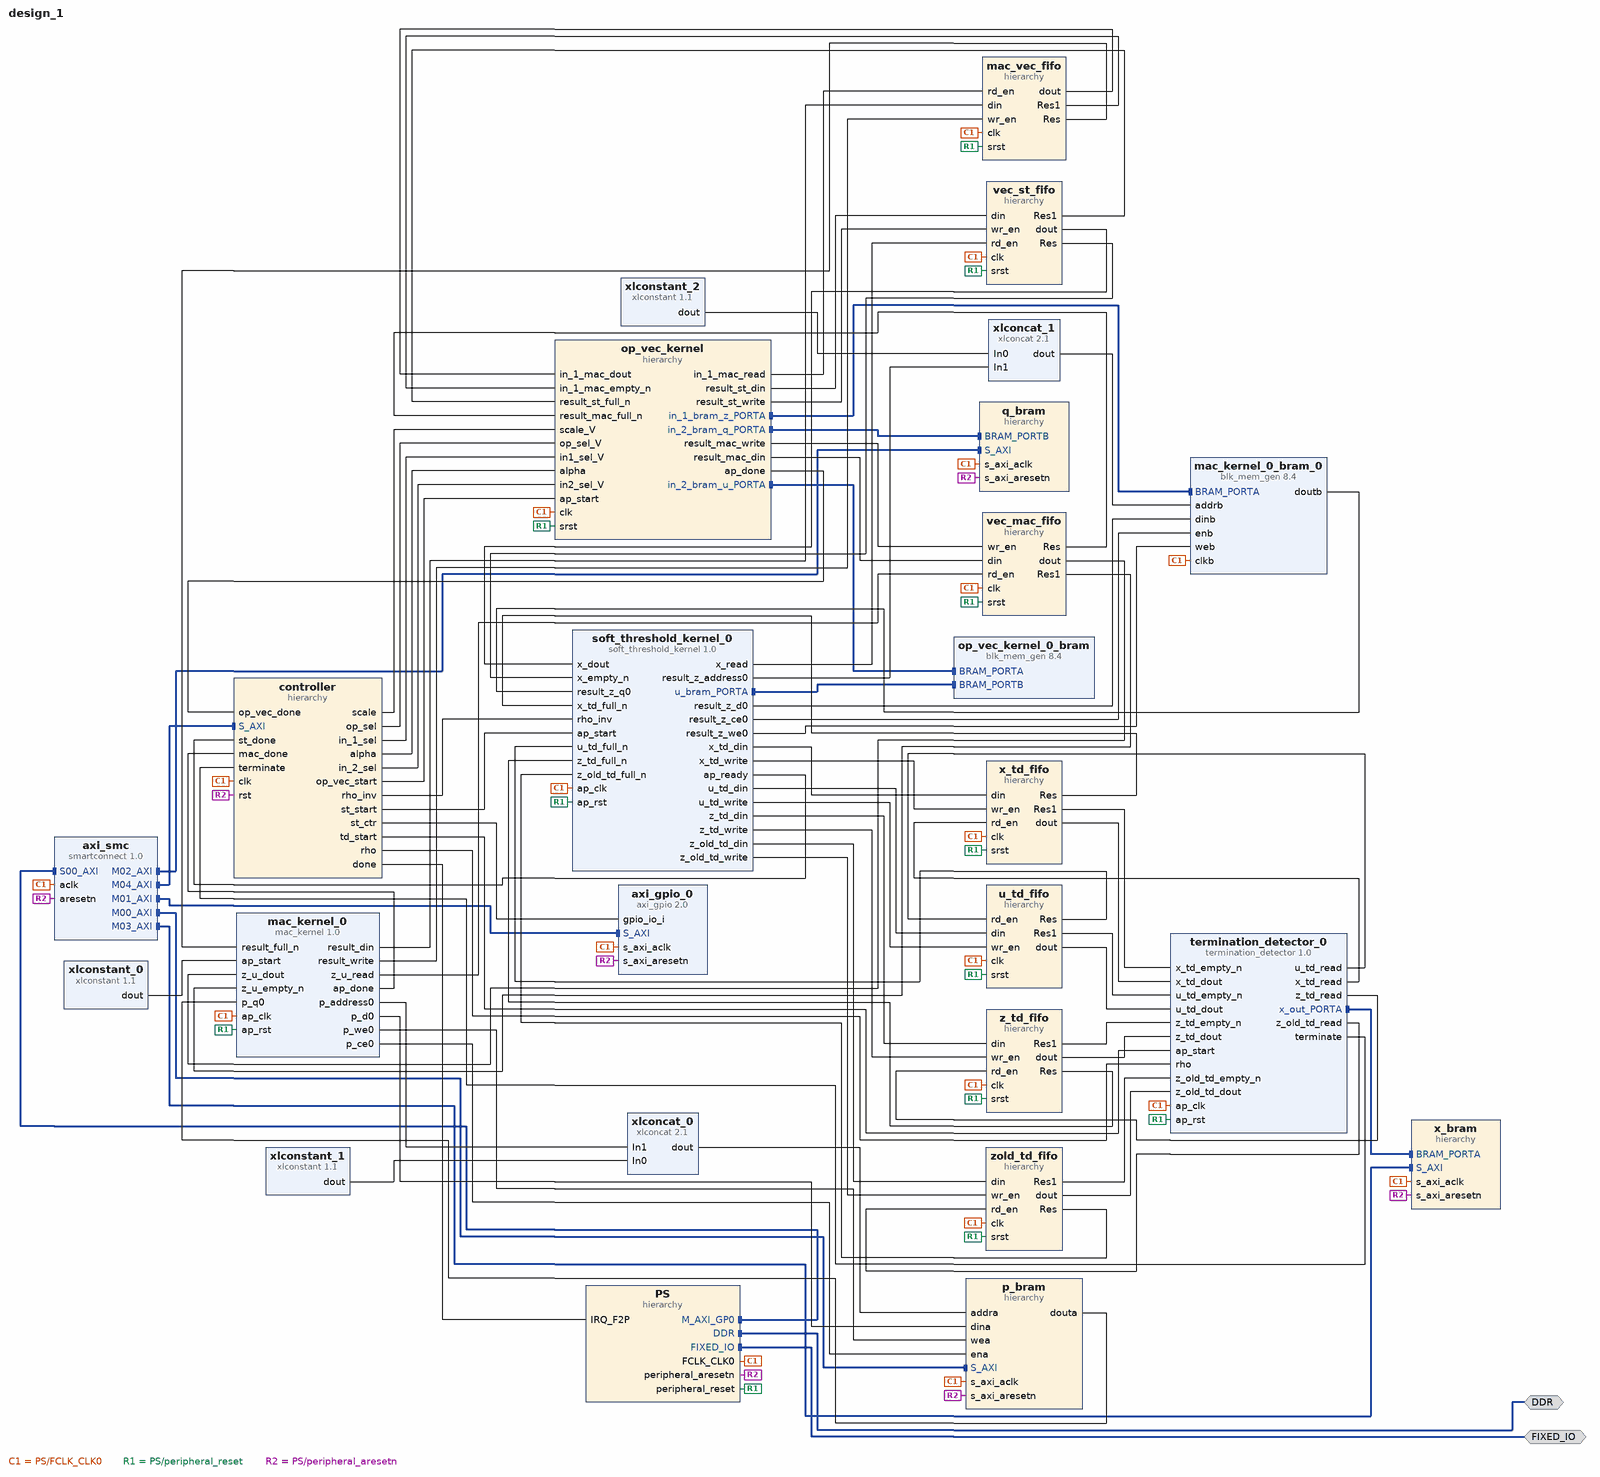
[diagram p0: block diagram of the top level]
# Vivado block design design_1, xc7z020clg484-1, Vivado 2018.3
create_bd_design design_1

create_bd_intf_port -mode Master -vlnv xilinx.com:interface:ddrx_rtl:1.0 DDR
create_bd_intf_port -mode Master -vlnv xilinx.com:display_processing_system7:fixedio_rtl:1.0 FIXED_IO

create_bd_cell -type ip -vlnv xilinx.com:ip:smartconnect:1.0 axi_smc
set_property -dict {CONFIG.NUM_MI 5 CONFIG.NUM_SI 1} [get_bd_cells axi_smc]
create_bd_cell -type ip -vlnv xilinx.com:ip:blk_mem_gen:8.4 mac_kernel_0_bram_0
set_property -dict [list \
  CONFIG.Enable_B Use_ENB_Pin \
  CONFIG.Memory_Type True_Dual_Port_RAM \
  CONFIG.Port_B_Clock 100 \
  CONFIG.Port_B_Enable_Rate 100 \
  CONFIG.Port_B_Write_Rate 50 \
  CONFIG.Use_RSTB_Pin true \
] [get_bd_cells mac_kernel_0_bram_0]
create_bd_cell -type ip -vlnv xilinx.com:ip:blk_mem_gen:8.4 op_vec_kernel_0_bram
set_property -dict [list \
  CONFIG.Enable_B Use_ENB_Pin \
  CONFIG.Memory_Type True_Dual_Port_RAM \
  CONFIG.Port_B_Clock 100 \
  CONFIG.Port_B_Enable_Rate 100 \
  CONFIG.Port_B_Write_Rate 50 \
  CONFIG.Use_RSTB_Pin true \
] [get_bd_cells op_vec_kernel_0_bram]
create_bd_cell -type hier PS
create_bd_cell -type ip -vlnv xilinx.com:hls:mac_kernel:1.0 mac_kernel_0
create_bd_cell -type hier q_bram
create_bd_cell -type hier x_bram
create_bd_cell -type hier p_bram
create_bd_cell -type hier vec_mac_fifo
create_bd_cell -type hier mac_vec_fifo
create_bd_cell -type hier vec_st_fifo
create_bd_cell -type hier op_vec_kernel
create_bd_cell -type hier controller
create_bd_cell -type ip -vlnv xilinx.com:ip:axi_gpio:2.0 axi_gpio_0
set_property -dict {CONFIG.C_ALL_INPUTS 1 CONFIG.C_GPIO_WIDTH 16} [get_bd_cells axi_gpio_0]
create_bd_cell -type ip -vlnv xilinx.com:ip:xlconstant:1.1 xlconstant_0
create_bd_cell -type ip -vlnv xilinx.com:ip:xlconcat:2.1 xlconcat_0
create_bd_cell -type ip -vlnv xilinx.com:ip:xlconstant:1.1 xlconstant_1
set_property -dict {CONFIG.CONST_VAL 0 CONFIG.CONST_WIDTH 2} [get_bd_cells xlconstant_1]
create_bd_cell -type ip -vlnv xilinx.com:hls:soft_threshold_kernel:1.0 soft_threshold_kernel_0
create_bd_cell -type ip -vlnv xilinx.com:ip:xlconcat:2.1 xlconcat_1
create_bd_cell -type ip -vlnv xilinx.com:ip:xlconstant:1.1 xlconstant_2
set_property -dict {CONFIG.CONST_VAL 0 CONFIG.CONST_WIDTH 2} [get_bd_cells xlconstant_2]
create_bd_cell -type hier z_td_fifo
create_bd_cell -type hier x_td_fifo
create_bd_cell -type hier zold_td_fifo
create_bd_cell -type hier u_td_fifo
create_bd_cell -type ip -vlnv xilinx.com:hls:termination_detector:1.0 termination_detector_0

# ---- hierarchy /PS ----
current_bd_instance /PS
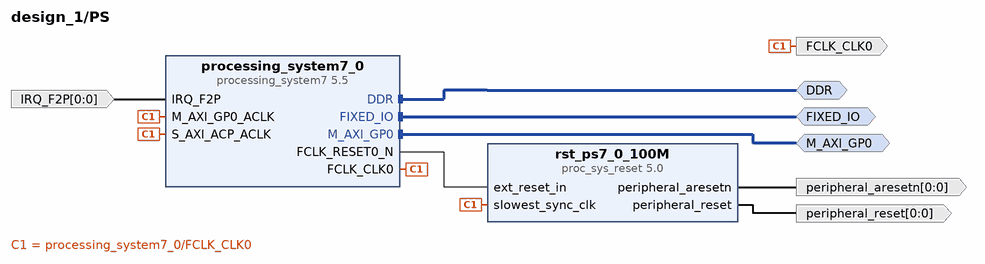
[diagram p1: block diagram inside /PS]
create_bd_intf_pin -mode Master -vlnv xilinx.com:interface:ddrx_rtl:1.0 DDR
create_bd_intf_pin -mode Master -vlnv xilinx.com:display_processing_system7:fixedio_rtl:1.0 FIXED_IO
create_bd_intf_pin -mode Master -vlnv xilinx.com:interface:aximm_rtl:1.0 M_AXI_GP0
create_bd_pin -dir O -type clk FCLK_CLK0
create_bd_pin -dir O -from 0 -to 0 -type rst peripheral_reset
create_bd_pin -dir O -from 0 -to 0 -type rst peripheral_aresetn
create_bd_pin -dir I -from 0 -to 0 -type intr IRQ_F2P

create_bd_cell -type ip -vlnv xilinx.com:ip:proc_sys_reset:5.0 rst_ps7_0_100M
create_bd_cell -type ip -vlnv xilinx.com:ip:processing_system7:5.5 processing_system7_0
set_property -dict [list \
  CONFIG.PCW_APU_PERIPHERAL_FREQMHZ 666.666667 \
  CONFIG.PCW_ENET0_ENET0_IO {MIO 16 .. 27} \
  CONFIG.PCW_ENET0_GRP_MDIO_ENABLE 1 \
  CONFIG.PCW_ENET0_GRP_MDIO_IO {MIO 52 .. 53} \
  CONFIG.PCW_ENET0_PERIPHERAL_ENABLE 1 \
  CONFIG.PCW_ENET0_RESET_ENABLE 0 \
  CONFIG.PCW_ENET_RESET_ENABLE 1 \
  CONFIG.PCW_ENET_RESET_SELECT {Share reset pin} \
  CONFIG.PCW_FPGA0_PERIPHERAL_FREQMHZ 100.000000 \
  CONFIG.PCW_FPGA1_PERIPHERAL_FREQMHZ 150.000000 \
  CONFIG.PCW_GPIO_MIO_GPIO_ENABLE 1 \
  CONFIG.PCW_GPIO_MIO_GPIO_IO MIO \
  CONFIG.PCW_I2C_RESET_ENABLE 1 \
  CONFIG.PCW_IRQ_F2P_INTR 1 \
  CONFIG.PCW_PRESET_BANK1_VOLTAGE {LVCMOS 1.8V} \
  CONFIG.PCW_QSPI_GRP_SINGLE_SS_ENABLE 1 \
  CONFIG.PCW_QSPI_GRP_SINGLE_SS_IO {MIO 1 .. 6} \
  CONFIG.PCW_QSPI_PERIPHERAL_ENABLE 1 \
  CONFIG.PCW_QSPI_QSPI_IO {MIO 1 .. 6} \
  CONFIG.PCW_SD0_GRP_CD_ENABLE 1 \
  CONFIG.PCW_SD0_GRP_CD_IO {MIO 47} \
  CONFIG.PCW_SD0_GRP_WP_ENABLE 1 \
  CONFIG.PCW_SD0_GRP_WP_IO {MIO 46} \
  CONFIG.PCW_SD0_PERIPHERAL_ENABLE 1 \
  CONFIG.PCW_SD0_SD0_IO {MIO 40 .. 45} \
  CONFIG.PCW_SDIO_PERIPHERAL_FREQMHZ 50 \
  CONFIG.PCW_SINGLE_QSPI_DATA_MODE x4 \
  CONFIG.PCW_TTC0_PERIPHERAL_ENABLE 1 \
  CONFIG.PCW_TTC0_TTC0_IO EMIO \
  CONFIG.PCW_UART1_PERIPHERAL_ENABLE 1 \
  CONFIG.PCW_UART1_UART1_IO {MIO 48 .. 49} \
  CONFIG.PCW_UART_PERIPHERAL_FREQMHZ 50 \
  CONFIG.PCW_UIPARAM_DDR_FREQ_MHZ 533.333313 \
  CONFIG.PCW_UIPARAM_DDR_PARTNO {MT41J128M16 HA-15E} \
  CONFIG.PCW_USB0_PERIPHERAL_ENABLE 1 \
  CONFIG.PCW_USB0_RESET_ENABLE 0 \
  CONFIG.PCW_USB0_USB0_IO {MIO 28 .. 39} \
  CONFIG.PCW_USB_RESET_ENABLE 1 \
  CONFIG.PCW_USB_RESET_SELECT {Share reset pin} \
  CONFIG.PCW_USE_FABRIC_INTERRUPT 1 \
  CONFIG.PCW_USE_S_AXI_ACP 1 \
  CONFIG.preset ZedBoard \
] [get_bd_cells processing_system7_0]
# 224 more settings of processing_system7_0 are not shown: defaults, MIO pin electricals, DDR timing, and values the tool derives

# ---- hierarchy /q_bram ----
current_bd_instance /q_bram
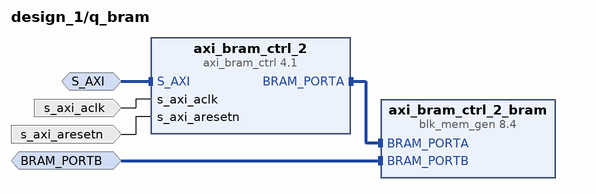
[diagram p2: block diagram inside /q_bram]
create_bd_intf_pin -mode Slave -vlnv xilinx.com:interface:aximm_rtl:1.0 S_AXI
create_bd_intf_pin -mode Slave -vlnv xilinx.com:interface:bram_rtl:1.0 BRAM_PORTB
create_bd_pin -dir I -type clk s_axi_aclk
create_bd_pin -dir I -type rst s_axi_aresetn

create_bd_cell -type ip -vlnv xilinx.com:ip:axi_bram_ctrl:4.1 axi_bram_ctrl_2
set_property -dict {CONFIG.SINGLE_PORT_BRAM 1} [get_bd_cells axi_bram_ctrl_2]
create_bd_cell -type ip -vlnv xilinx.com:ip:blk_mem_gen:8.4 axi_bram_ctrl_2_bram
set_property -dict [list \
  CONFIG.Enable_B Use_ENB_Pin \
  CONFIG.Memory_Type True_Dual_Port_RAM \
  CONFIG.Port_B_Clock 100 \
  CONFIG.Port_B_Enable_Rate 100 \
  CONFIG.Port_B_Write_Rate 50 \
  CONFIG.Use_RSTB_Pin true \
] [get_bd_cells axi_bram_ctrl_2_bram]

# ---- hierarchy /x_bram ----
current_bd_instance /x_bram
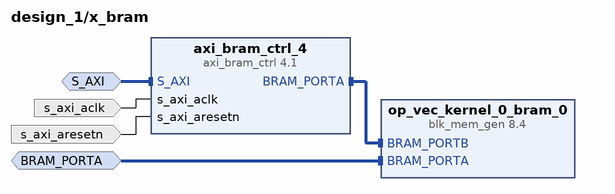
[diagram p3: block diagram inside /x_bram]
create_bd_intf_pin -mode Slave -vlnv xilinx.com:interface:bram_rtl:1.0 BRAM_PORTA
create_bd_intf_pin -mode Slave -vlnv xilinx.com:interface:aximm_rtl:1.0 S_AXI
create_bd_pin -dir I -type clk s_axi_aclk
create_bd_pin -dir I -type rst s_axi_aresetn

create_bd_cell -type ip -vlnv xilinx.com:ip:blk_mem_gen:8.4 op_vec_kernel_0_bram_0
set_property -dict [list \
  CONFIG.Enable_B Use_ENB_Pin \
  CONFIG.Memory_Type True_Dual_Port_RAM \
  CONFIG.Port_B_Clock 100 \
  CONFIG.Port_B_Enable_Rate 100 \
  CONFIG.Port_B_Write_Rate 50 \
  CONFIG.Use_RSTB_Pin true \
] [get_bd_cells op_vec_kernel_0_bram_0]
create_bd_cell -type ip -vlnv xilinx.com:ip:axi_bram_ctrl:4.1 axi_bram_ctrl_4
set_property -dict {CONFIG.SINGLE_PORT_BRAM 1} [get_bd_cells axi_bram_ctrl_4]

# ---- hierarchy /p_bram ----
current_bd_instance /p_bram
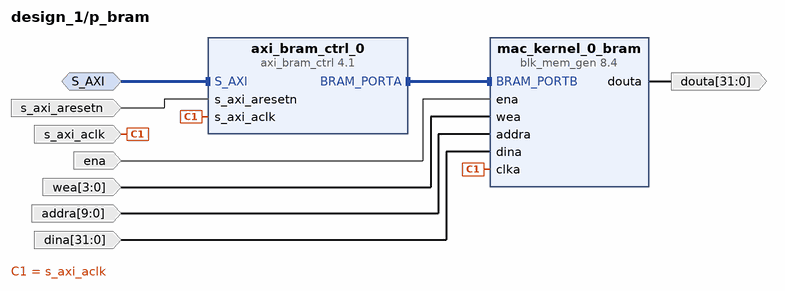
[diagram p4: block diagram inside /p_bram]
create_bd_intf_pin -mode Slave -vlnv xilinx.com:interface:aximm_rtl:1.0 S_AXI
create_bd_pin -dir I -type clk s_axi_aclk
create_bd_pin -dir I ena
create_bd_pin -dir I -from 3 -to 0 wea
create_bd_pin -dir I -from 9 -to 0 addra
create_bd_pin -dir I -from 31 -to 0 dina
create_bd_pin -dir O -from 31 -to 0 douta
create_bd_pin -dir I -type rst s_axi_aresetn

create_bd_cell -type ip -vlnv xilinx.com:ip:blk_mem_gen:8.4 mac_kernel_0_bram
set_property -dict [list \
  CONFIG.Enable_B Use_ENB_Pin \
  CONFIG.Memory_Type True_Dual_Port_RAM \
  CONFIG.Port_B_Clock 100 \
  CONFIG.Port_B_Enable_Rate 100 \
  CONFIG.Port_B_Write_Rate 50 \
  CONFIG.Use_RSTB_Pin true \
] [get_bd_cells mac_kernel_0_bram]
create_bd_cell -type ip -vlnv xilinx.com:ip:axi_bram_ctrl:4.1 axi_bram_ctrl_0
set_property -dict {CONFIG.SINGLE_PORT_BRAM 1} [get_bd_cells axi_bram_ctrl_0]

# ---- hierarchy /vec_mac_fifo ----
current_bd_instance /vec_mac_fifo
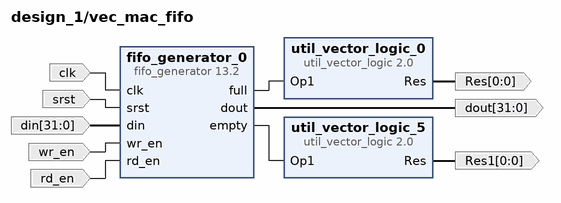
[diagram p5: block diagram inside /vec_mac_fifo]
create_bd_pin -dir O -from 0 -to 0 Res
create_bd_pin -dir O -from 0 -to 0 Res1
create_bd_pin -dir I -type clk clk
create_bd_pin -dir I srst
create_bd_pin -dir I -from 31 -to 0 din
create_bd_pin -dir I wr_en
create_bd_pin -dir I rd_en
create_bd_pin -dir O -from 31 -to 0 dout

create_bd_cell -type ip -vlnv xilinx.com:ip:util_vector_logic:2.0 util_vector_logic_0
set_property -dict {CONFIG.C_OPERATION not CONFIG.C_SIZE 1} [get_bd_cells util_vector_logic_0]
create_bd_cell -type ip -vlnv xilinx.com:ip:util_vector_logic:2.0 util_vector_logic_5
set_property -dict {CONFIG.C_OPERATION not CONFIG.C_SIZE 1} [get_bd_cells util_vector_logic_5]
create_bd_cell -type ip -vlnv xilinx.com:ip:fifo_generator:13.2 fifo_generator_0
set_property -dict [list \
  CONFIG.Data_Count false \
  CONFIG.Input_Data_Width 32 \
  CONFIG.Input_Depth 256 \
  CONFIG.Output_Data_Width 32 \
  CONFIG.Performance_Options First_Word_Fall_Through \
  CONFIG.Reset_Pin true \
  CONFIG.Reset_Type Synchronous_Reset \
  CONFIG.Use_Dout_Reset true \
] [get_bd_cells fifo_generator_0]

# ---- hierarchy /mac_vec_fifo ----
current_bd_instance /mac_vec_fifo
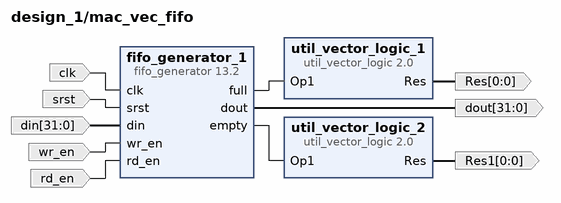
[diagram p6: block diagram inside /mac_vec_fifo]
create_bd_pin -dir O -from 0 -to 0 Res
create_bd_pin -dir O -from 0 -to 0 Res1
create_bd_pin -dir I -type clk clk
create_bd_pin -dir I srst
create_bd_pin -dir I -from 31 -to 0 din
create_bd_pin -dir I wr_en
create_bd_pin -dir I rd_en
create_bd_pin -dir O -from 31 -to 0 dout

create_bd_cell -type ip -vlnv xilinx.com:ip:util_vector_logic:2.0 util_vector_logic_1
set_property -dict {CONFIG.C_OPERATION not CONFIG.C_SIZE 1} [get_bd_cells util_vector_logic_1]
create_bd_cell -type ip -vlnv xilinx.com:ip:util_vector_logic:2.0 util_vector_logic_2
set_property -dict {CONFIG.C_OPERATION not CONFIG.C_SIZE 1} [get_bd_cells util_vector_logic_2]
create_bd_cell -type ip -vlnv xilinx.com:ip:fifo_generator:13.2 fifo_generator_1
set_property -dict [list \
  CONFIG.Input_Data_Width 32 \
  CONFIG.Input_Depth 128 \
  CONFIG.Output_Data_Width 32 \
  CONFIG.Performance_Options First_Word_Fall_Through \
] [get_bd_cells fifo_generator_1]

# ---- hierarchy /vec_st_fifo ----
current_bd_instance /vec_st_fifo
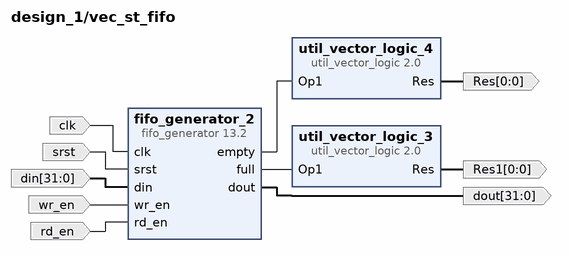
[diagram p7: block diagram inside /vec_st_fifo]
create_bd_pin -dir O -from 0 -to 0 Res
create_bd_pin -dir I -type clk clk
create_bd_pin -dir I srst
create_bd_pin -dir I -from 31 -to 0 din
create_bd_pin -dir I wr_en
create_bd_pin -dir I rd_en
create_bd_pin -dir O -from 31 -to 0 dout
create_bd_pin -dir O -from 0 -to 0 Res1

create_bd_cell -type ip -vlnv xilinx.com:ip:util_vector_logic:2.0 util_vector_logic_4
set_property -dict {CONFIG.C_OPERATION not CONFIG.C_SIZE 1} [get_bd_cells util_vector_logic_4]
create_bd_cell -type ip -vlnv xilinx.com:ip:fifo_generator:13.2 fifo_generator_2
set_property -dict [list \
  CONFIG.Data_Count true \
  CONFIG.Data_Count_Width 8 \
  CONFIG.Input_Data_Width 32 \
  CONFIG.Input_Depth 128 \
  CONFIG.Output_Data_Width 32 \
  CONFIG.Performance_Options First_Word_Fall_Through \
] [get_bd_cells fifo_generator_2]
create_bd_cell -type ip -vlnv xilinx.com:ip:util_vector_logic:2.0 util_vector_logic_3
set_property -dict {CONFIG.C_OPERATION not CONFIG.C_SIZE 1} [get_bd_cells util_vector_logic_3]

# ---- hierarchy /op_vec_kernel ----
current_bd_instance /op_vec_kernel
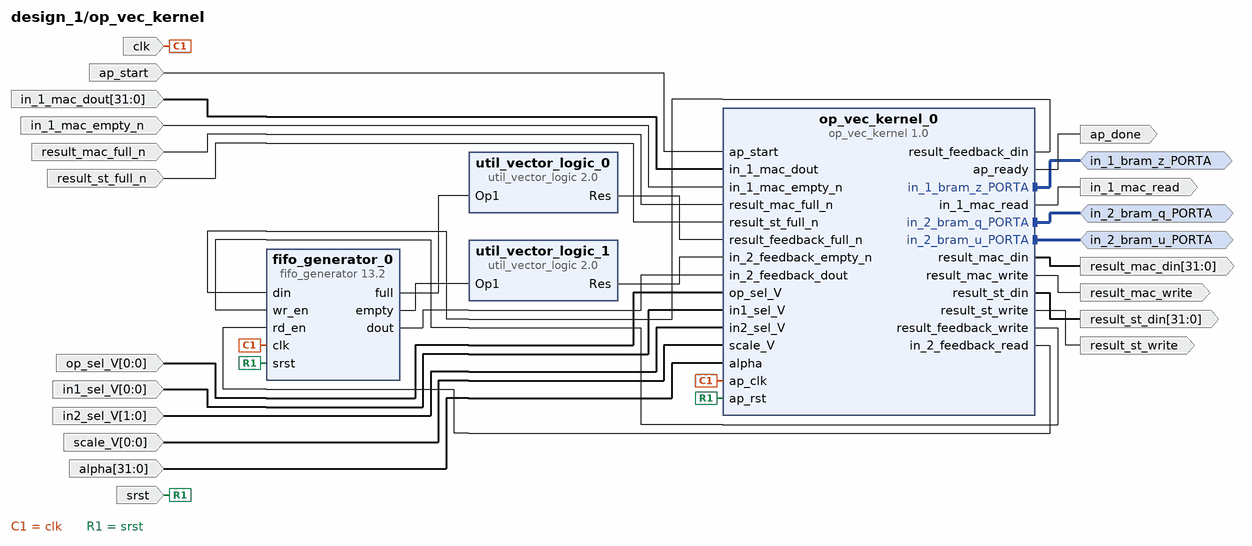
[diagram p8: block diagram inside /op_vec_kernel]
create_bd_intf_pin -mode Master -vlnv xilinx.com:interface:bram_rtl:1.0 in_1_bram_z_PORTA
create_bd_intf_pin -mode Master -vlnv xilinx.com:interface:bram_rtl:1.0 in_2_bram_u_PORTA
create_bd_intf_pin -mode Master -vlnv xilinx.com:interface:bram_rtl:1.0 in_2_bram_q_PORTA
create_bd_pin -dir I -type clk clk
create_bd_pin -dir I srst
create_bd_pin -dir I ap_start
create_bd_pin -dir O ap_done
create_bd_pin -dir I -from 31 -to 0 in_1_mac_dout
create_bd_pin -dir I in_1_mac_empty_n
create_bd_pin -dir O in_1_mac_read
create_bd_pin -dir O -from 31 -to 0 result_mac_din
create_bd_pin -dir I result_mac_full_n
create_bd_pin -dir O result_mac_write
create_bd_pin -dir O -from 31 -to 0 result_st_din
create_bd_pin -dir I result_st_full_n
create_bd_pin -dir O result_st_write
create_bd_pin -dir I -from 0 -to 0 -type data op_sel_V
create_bd_pin -dir I -from 0 -to 0 -type data in1_sel_V
create_bd_pin -dir I -from 1 -to 0 -type data in2_sel_V
create_bd_pin -dir I -from 0 -to 0 -type data scale_V
create_bd_pin -dir I -from 31 -to 0 -type data alpha

create_bd_cell -type ip -vlnv xilinx.com:ip:fifo_generator:13.2 fifo_generator_0
set_property -dict [list \
  CONFIG.Input_Data_Width 32 \
  CONFIG.Input_Depth 128 \
  CONFIG.Output_Data_Width 32 \
  CONFIG.Performance_Options First_Word_Fall_Through \
] [get_bd_cells fifo_generator_0]
create_bd_cell -type ip -vlnv xilinx.com:ip:util_vector_logic:2.0 util_vector_logic_0
set_property -dict {CONFIG.C_OPERATION not CONFIG.C_SIZE 1} [get_bd_cells util_vector_logic_0]
create_bd_cell -type ip -vlnv xilinx.com:ip:util_vector_logic:2.0 util_vector_logic_1
set_property -dict {CONFIG.C_OPERATION not CONFIG.C_SIZE 1} [get_bd_cells util_vector_logic_1]
create_bd_cell -type ip -vlnv xilinx.com:hls:op_vec_kernel:1.0 op_vec_kernel_0

# ---- hierarchy /controller ----
current_bd_instance /controller
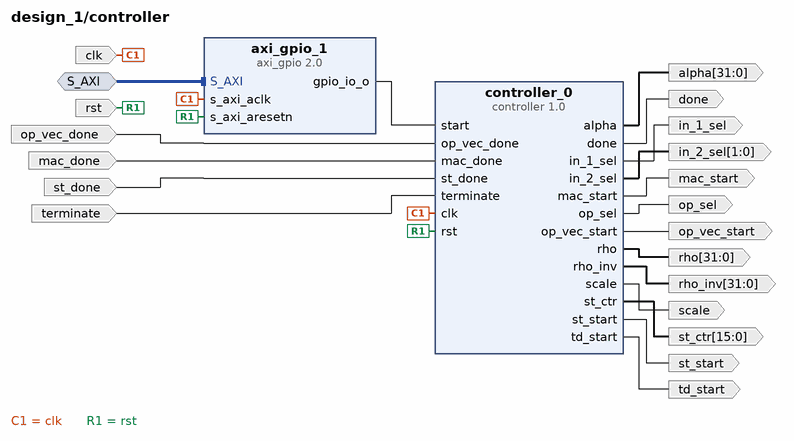
[diagram p9: block diagram inside /controller]
create_bd_intf_pin -mode Slave -vlnv xilinx.com:interface:aximm_rtl:1.0 S_AXI
create_bd_pin -dir I -type clk clk
create_bd_pin -dir I -type rst rst
create_bd_pin -dir I op_vec_done
create_bd_pin -dir I mac_done
create_bd_pin -dir I st_done
create_bd_pin -dir O done
create_bd_pin -dir O scale
create_bd_pin -dir O op_sel
create_bd_pin -dir O in_1_sel
create_bd_pin -dir O -from 31 -to 0 alpha
create_bd_pin -dir O -from 31 -to 0 rho_inv
create_bd_pin -dir O -from 1 -to 0 in_2_sel
create_bd_pin -dir O op_vec_start
create_bd_pin -dir O mac_start
create_bd_pin -dir O st_start
create_bd_pin -dir O -from 15 -to 0 st_ctr
create_bd_pin -dir I terminate
create_bd_pin -dir O td_start
create_bd_pin -dir O -from 31 -to 0 rho

create_bd_cell -type ip -vlnv xilinx.com:ip:axi_gpio:2.0 axi_gpio_1
set_property -dict {CONFIG.C_ALL_INPUTS 0 CONFIG.C_ALL_OUTPUTS 1 CONFIG.C_GPIO_WIDTH 1} [get_bd_cells axi_gpio_1]
create_bd_cell -type ip -vlnv xilinx.com:user:controller:1.0 controller_0
set_property -dict {CONFIG.ITERATION_COUNT 2} [get_bd_cells controller_0]

# ---- hierarchy /z_td_fifo ----
current_bd_instance /z_td_fifo
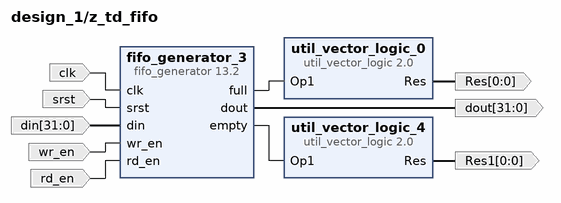
[diagram p10: block diagram inside /z_td_fifo]
create_bd_pin -dir O -from 0 -to 0 Res
create_bd_pin -dir I -type clk clk
create_bd_pin -dir I srst
create_bd_pin -dir I -from 31 -to 0 din
create_bd_pin -dir I wr_en
create_bd_pin -dir I rd_en
create_bd_pin -dir O -from 31 -to 0 dout
create_bd_pin -dir O -from 0 -to 0 Res1

create_bd_cell -type ip -vlnv xilinx.com:ip:util_vector_logic:2.0 util_vector_logic_0
set_property -dict {CONFIG.C_OPERATION not CONFIG.C_SIZE 1} [get_bd_cells util_vector_logic_0]
create_bd_cell -type ip -vlnv xilinx.com:ip:fifo_generator:13.2 fifo_generator_3
set_property -dict [list \
  CONFIG.Input_Data_Width 32 \
  CONFIG.Input_Depth 128 \
  CONFIG.Output_Data_Width 32 \
  CONFIG.Performance_Options First_Word_Fall_Through \
] [get_bd_cells fifo_generator_3]
create_bd_cell -type ip -vlnv xilinx.com:ip:util_vector_logic:2.0 util_vector_logic_4
set_property -dict {CONFIG.C_OPERATION not CONFIG.C_SIZE 1} [get_bd_cells util_vector_logic_4]

# ---- hierarchy /x_td_fifo ----
current_bd_instance /x_td_fifo
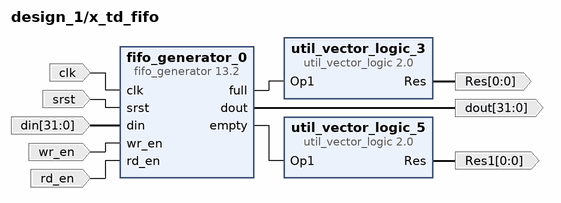
[diagram p11: block diagram inside /x_td_fifo]
create_bd_pin -dir O -from 0 -to 0 Res
create_bd_pin -dir I -type clk clk
create_bd_pin -dir I srst
create_bd_pin -dir I -from 31 -to 0 din
create_bd_pin -dir I wr_en
create_bd_pin -dir I rd_en
create_bd_pin -dir O -from 31 -to 0 dout
create_bd_pin -dir O -from 0 -to 0 Res1

create_bd_cell -type ip -vlnv xilinx.com:ip:util_vector_logic:2.0 util_vector_logic_3
set_property -dict {CONFIG.C_OPERATION not CONFIG.C_SIZE 1} [get_bd_cells util_vector_logic_3]
create_bd_cell -type ip -vlnv xilinx.com:ip:fifo_generator:13.2 fifo_generator_0
set_property -dict [list \
  CONFIG.Input_Data_Width 32 \
  CONFIG.Input_Depth 128 \
  CONFIG.Output_Data_Width 32 \
  CONFIG.Performance_Options First_Word_Fall_Through \
] [get_bd_cells fifo_generator_0]
create_bd_cell -type ip -vlnv xilinx.com:ip:util_vector_logic:2.0 util_vector_logic_5
set_property -dict {CONFIG.C_OPERATION not CONFIG.C_SIZE 1} [get_bd_cells util_vector_logic_5]

# ---- hierarchy /zold_td_fifo ----
current_bd_instance /zold_td_fifo
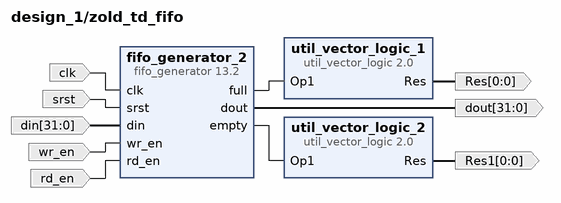
[diagram p12: block diagram inside /zold_td_fifo]
create_bd_pin -dir O -from 0 -to 0 Res
create_bd_pin -dir I -type clk clk
create_bd_pin -dir I srst
create_bd_pin -dir I -from 31 -to 0 din
create_bd_pin -dir I wr_en
create_bd_pin -dir I rd_en
create_bd_pin -dir O -from 31 -to 0 dout
create_bd_pin -dir O -from 0 -to 0 Res1

create_bd_cell -type ip -vlnv xilinx.com:ip:util_vector_logic:2.0 util_vector_logic_1
set_property -dict {CONFIG.C_OPERATION not CONFIG.C_SIZE 1} [get_bd_cells util_vector_logic_1]
create_bd_cell -type ip -vlnv xilinx.com:ip:fifo_generator:13.2 fifo_generator_2
set_property -dict [list \
  CONFIG.Input_Data_Width 32 \
  CONFIG.Input_Depth 128 \
  CONFIG.Output_Data_Width 32 \
  CONFIG.Performance_Options First_Word_Fall_Through \
] [get_bd_cells fifo_generator_2]
create_bd_cell -type ip -vlnv xilinx.com:ip:util_vector_logic:2.0 util_vector_logic_2
set_property -dict {CONFIG.C_OPERATION not CONFIG.C_SIZE 1} [get_bd_cells util_vector_logic_2]

# ---- hierarchy /u_td_fifo ----
current_bd_instance /u_td_fifo
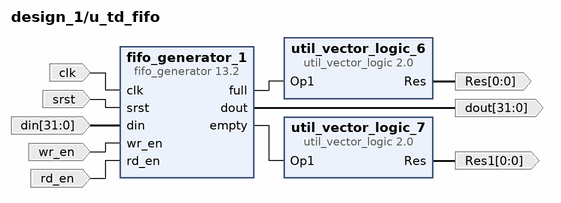
[diagram p13: block diagram inside /u_td_fifo]
create_bd_pin -dir O -from 0 -to 0 Res
create_bd_pin -dir I -type clk clk
create_bd_pin -dir I srst
create_bd_pin -dir I -from 31 -to 0 din
create_bd_pin -dir I wr_en
create_bd_pin -dir I rd_en
create_bd_pin -dir O -from 31 -to 0 dout
create_bd_pin -dir O -from 0 -to 0 Res1

create_bd_cell -type ip -vlnv xilinx.com:ip:util_vector_logic:2.0 util_vector_logic_6
set_property -dict {CONFIG.C_OPERATION not CONFIG.C_SIZE 1} [get_bd_cells util_vector_logic_6]
create_bd_cell -type ip -vlnv xilinx.com:ip:fifo_generator:13.2 fifo_generator_1
set_property -dict [list \
  CONFIG.Input_Data_Width 32 \
  CONFIG.Input_Depth 128 \
  CONFIG.Output_Data_Width 32 \
  CONFIG.Performance_Options First_Word_Fall_Through \
] [get_bd_cells fifo_generator_1]
create_bd_cell -type ip -vlnv xilinx.com:ip:util_vector_logic:2.0 util_vector_logic_7
set_property -dict {CONFIG.C_OPERATION not CONFIG.C_SIZE 1} [get_bd_cells util_vector_logic_7]

# ---- connections ----

current_bd_instance /PS
connect_bd_intf_net [get_bd_intf_pins M_AXI_GP0] [get_bd_intf_pins processing_system7_0/M_AXI_GP0]
connect_bd_intf_net [get_bd_intf_pins FIXED_IO] [get_bd_intf_pins processing_system7_0/FIXED_IO]
connect_bd_intf_net [get_bd_intf_pins DDR] [get_bd_intf_pins processing_system7_0/DDR]
connect_bd_net [get_bd_pins processing_system7_0/FCLK_RESET0_N] [get_bd_pins rst_ps7_0_100M/ext_reset_in]
connect_bd_net [get_bd_pins processing_system7_0/FCLK_CLK0] \
  [get_bd_pins FCLK_CLK0] [get_bd_pins processing_system7_0/M_AXI_GP0_ACLK] [get_bd_pins processing_system7_0/S_AXI_ACP_ACLK] \
  [get_bd_pins rst_ps7_0_100M/slowest_sync_clk]
connect_bd_net [get_bd_pins rst_ps7_0_100M/peripheral_reset] [get_bd_pins peripheral_reset]
connect_bd_net [get_bd_pins rst_ps7_0_100M/peripheral_aresetn] [get_bd_pins peripheral_aresetn]
connect_bd_net -net mac_kernel_0_interrupt [get_bd_pins IRQ_F2P] [get_bd_pins processing_system7_0/IRQ_F2P]
set_property HDL_ATTRIBUTE.BMM_INFO_PROCESSOR {arm > design_1 x_bram/axi_bram_ctrl_4 design_1 q_bram/axi_bram_ctrl_2 design_1 p_bram/axi_bram_ctrl_0} [get_bd_cells processing_system7_0]
set_property HDL_ATTRIBUTE.KEEP_HIERARCHY yes [get_bd_cells processing_system7_0]

current_bd_instance /q_bram
connect_bd_intf_net -intf_net axi_smc_M02_AXI [get_bd_intf_pins S_AXI] [get_bd_intf_pins axi_bram_ctrl_2/S_AXI]
connect_bd_intf_net -intf_net op_vec_kernel_0_in_2_bram_q_PORTA [get_bd_intf_pins BRAM_PORTB] [get_bd_intf_pins axi_bram_ctrl_2_bram/BRAM_PORTB]
connect_bd_intf_net [get_bd_intf_pins axi_bram_ctrl_2_bram/BRAM_PORTA] [get_bd_intf_pins axi_bram_ctrl_2/BRAM_PORTA]
connect_bd_net -net processing_system7_0_FCLK_CLK0 [get_bd_pins s_axi_aclk] [get_bd_pins axi_bram_ctrl_2/s_axi_aclk]
connect_bd_net -net rst_ps7_0_100M_peripheral_aresetn [get_bd_pins s_axi_aresetn] [get_bd_pins axi_bram_ctrl_2/s_axi_aresetn]
set_property HDL_ATTRIBUTE.BMM_INFO_ADDRESS_SPACE {byte  0x44000000 32 > design_1 q_bram/axi_bram_ctrl_2_bram} [get_bd_cells axi_bram_ctrl_2]
set_property HDL_ATTRIBUTE.KEEP_HIERARCHY yes [get_bd_cells axi_bram_ctrl_2]

current_bd_instance /x_bram
connect_bd_intf_net -intf_net op_vec_kernel_0_x_PORTA [get_bd_intf_pins BRAM_PORTA] [get_bd_intf_pins op_vec_kernel_0_bram_0/BRAM_PORTA]
connect_bd_intf_net [get_bd_intf_pins axi_bram_ctrl_4/BRAM_PORTA] [get_bd_intf_pins op_vec_kernel_0_bram_0/BRAM_PORTB]
connect_bd_intf_net -intf_net axi_smc_M03_AXI [get_bd_intf_pins S_AXI] [get_bd_intf_pins axi_bram_ctrl_4/S_AXI]
connect_bd_net -net processing_system7_0_FCLK_CLK0 [get_bd_pins s_axi_aclk] [get_bd_pins axi_bram_ctrl_4/s_axi_aclk]
connect_bd_net -net rst_ps7_0_100M_peripheral_aresetn [get_bd_pins s_axi_aresetn] [get_bd_pins axi_bram_ctrl_4/s_axi_aresetn]
set_property HDL_ATTRIBUTE.BMM_INFO_ADDRESS_SPACE {byte  0x40000000 32 > design_1 x_bram/op_vec_kernel_0_bram_0} [get_bd_cells axi_bram_ctrl_4]
set_property HDL_ATTRIBUTE.KEEP_HIERARCHY yes [get_bd_cells axi_bram_ctrl_4]

current_bd_instance /p_bram
connect_bd_intf_net -intf_net axi_smc_M00_AXI [get_bd_intf_pins S_AXI] [get_bd_intf_pins axi_bram_ctrl_0/S_AXI]
connect_bd_intf_net [get_bd_intf_pins mac_kernel_0_bram/BRAM_PORTB] [get_bd_intf_pins axi_bram_ctrl_0/BRAM_PORTA]
connect_bd_net -net processing_system7_0_FCLK_CLK0 [get_bd_pins s_axi_aclk] \
  [get_bd_pins axi_bram_ctrl_0/s_axi_aclk] [get_bd_pins mac_kernel_0_bram/clka]
connect_bd_net -net mac_kernel_0_p_ce0 [get_bd_pins ena] [get_bd_pins mac_kernel_0_bram/ena]
connect_bd_net -net mac_kernel_0_p_we0 [get_bd_pins wea] [get_bd_pins mac_kernel_0_bram/wea]
connect_bd_net -net mac_kernel_0_p_address0 [get_bd_pins addra] [get_bd_pins mac_kernel_0_bram/addra]
connect_bd_net -net mac_kernel_0_p_d0 [get_bd_pins dina] [get_bd_pins mac_kernel_0_bram/dina]
connect_bd_net [get_bd_pins mac_kernel_0_bram/douta] [get_bd_pins douta]
connect_bd_net -net rst_ps7_0_100M_peripheral_aresetn [get_bd_pins s_axi_aresetn] [get_bd_pins axi_bram_ctrl_0/s_axi_aresetn]
set_property HDL_ATTRIBUTE.BMM_INFO_ADDRESS_SPACE {byte  0x4B000000 32 > design_1 p_bram/mac_kernel_0_bram} [get_bd_cells axi_bram_ctrl_0]
set_property HDL_ATTRIBUTE.KEEP_HIERARCHY yes [get_bd_cells axi_bram_ctrl_0]

current_bd_instance /vec_mac_fifo
connect_bd_net [get_bd_pins fifo_generator_0/full] [get_bd_pins util_vector_logic_0/Op1]
connect_bd_net [get_bd_pins fifo_generator_0/empty] [get_bd_pins util_vector_logic_5/Op1]
connect_bd_net [get_bd_pins util_vector_logic_0/Res] [get_bd_pins Res]
connect_bd_net [get_bd_pins util_vector_logic_5/Res] [get_bd_pins Res1]
connect_bd_net -net processing_system7_0_FCLK_CLK0 [get_bd_pins clk] [get_bd_pins fifo_generator_0/clk]
connect_bd_net -net rst_ps7_0_100M_peripheral_reset [get_bd_pins srst] [get_bd_pins fifo_generator_0/srst]
connect_bd_net -net op_vec_kernel_0_result_mac_din [get_bd_pins din] [get_bd_pins fifo_generator_0/din]
connect_bd_net -net op_vec_kernel_0_result_mac_write [get_bd_pins wr_en] [get_bd_pins fifo_generator_0/wr_en]
connect_bd_net -net mac_kernel_0_z_u_read [get_bd_pins rd_en] [get_bd_pins fifo_generator_0/rd_en]
connect_bd_net [get_bd_pins fifo_generator_0/dout] [get_bd_pins dout]

current_bd_instance /mac_vec_fifo
connect_bd_net [get_bd_pins fifo_generator_1/full] [get_bd_pins util_vector_logic_1/Op1]
connect_bd_net [get_bd_pins fifo_generator_1/empty] [get_bd_pins util_vector_logic_2/Op1]
connect_bd_net [get_bd_pins util_vector_logic_1/Res] [get_bd_pins Res]
connect_bd_net [get_bd_pins util_vector_logic_2/Res] [get_bd_pins Res1]
connect_bd_net -net processing_system7_0_FCLK_CLK0 [get_bd_pins clk] [get_bd_pins fifo_generator_1/clk]
connect_bd_net -net rst_ps7_0_100M_peripheral_reset [get_bd_pins srst] [get_bd_pins fifo_generator_1/srst]
connect_bd_net -net mac_kernel_0_result_din [get_bd_pins din] [get_bd_pins fifo_generator_1/din]
connect_bd_net -net mac_kernel_0_result_write [get_bd_pins wr_en] [get_bd_pins fifo_generator_1/wr_en]
connect_bd_net -net op_vec_kernel_0_in_1_mac_read [get_bd_pins rd_en] [get_bd_pins fifo_generator_1/rd_en]
connect_bd_net [get_bd_pins fifo_generator_1/dout] [get_bd_pins dout]

current_bd_instance /vec_st_fifo
connect_bd_net [get_bd_pins fifo_generator_2/empty] [get_bd_pins util_vector_logic_4/Op1]
connect_bd_net [get_bd_pins fifo_generator_2/full] [get_bd_pins util_vector_logic_3/Op1]
connect_bd_net [get_bd_pins util_vector_logic_4/Res] [get_bd_pins Res]
connect_bd_net -net processing_system7_0_FCLK_CLK0 [get_bd_pins clk] [get_bd_pins fifo_generator_2/clk]
connect_bd_net -net rst_ps7_0_100M_peripheral_reset [get_bd_pins srst] [get_bd_pins fifo_generator_2/srst]
connect_bd_net -net op_vec_kernel_0_result_st_din [get_bd_pins din] [get_bd_pins fifo_generator_2/din]
connect_bd_net -net op_vec_kernel_0_result_st_write [get_bd_pins wr_en] [get_bd_pins fifo_generator_2/wr_en]
connect_bd_net -net soft_threshold_kernel_0_x_read [get_bd_pins rd_en] [get_bd_pins fifo_generator_2/rd_en]
connect_bd_net [get_bd_pins fifo_generator_2/dout] [get_bd_pins dout]
connect_bd_net [get_bd_pins util_vector_logic_3/Res] [get_bd_pins Res1]

current_bd_instance /op_vec_kernel
connect_bd_intf_net [get_bd_intf_pins in_2_bram_q_PORTA] [get_bd_intf_pins op_vec_kernel_0/in_2_bram_q_PORTA]
connect_bd_intf_net [get_bd_intf_pins in_2_bram_u_PORTA] [get_bd_intf_pins op_vec_kernel_0/in_2_bram_u_PORTA]
connect_bd_intf_net [get_bd_intf_pins in_1_bram_z_PORTA] [get_bd_intf_pins op_vec_kernel_0/in_1_bram_z_PORTA]
connect_bd_net -net processing_system7_0_FCLK_CLK0 [get_bd_pins clk] [get_bd_pins fifo_generator_0/clk] [get_bd_pins op_vec_kernel_0/ap_clk]
connect_bd_net -net rst_ps7_0_100M_peripheral_reset [get_bd_pins srst] [get_bd_pins fifo_generator_0/srst] [get_bd_pins op_vec_kernel_0/ap_rst]
connect_bd_net -net controller_0_op_vec_start [get_bd_pins ap_start] [get_bd_pins op_vec_kernel_0/ap_start]
connect_bd_net -net fifo_generator_1_dout [get_bd_pins in_1_mac_dout] [get_bd_pins op_vec_kernel_0/in_1_mac_dout]
connect_bd_net -net util_vector_logic_2_Res [get_bd_pins in_1_mac_empty_n] [get_bd_pins op_vec_kernel_0/in_1_mac_empty_n]
connect_bd_net [get_bd_pins op_vec_kernel_0/in_1_mac_read] [get_bd_pins in_1_mac_read]
connect_bd_net [get_bd_pins op_vec_kernel_0/result_mac_din] [get_bd_pins result_mac_din]
connect_bd_net -net util_vector_logic_0_Res [get_bd_pins result_mac_full_n] [get_bd_pins op_vec_kernel_0/result_mac_full_n]
connect_bd_net [get_bd_pins op_vec_kernel_0/result_mac_write] [get_bd_pins result_mac_write]
connect_bd_net [get_bd_pins op_vec_kernel_0/result_st_din] [get_bd_pins result_st_din]
connect_bd_net -net util_vector_logic_3_Res [get_bd_pins result_st_full_n] [get_bd_pins op_vec_kernel_0/result_st_full_n]
connect_bd_net [get_bd_pins op_vec_kernel_0/result_st_write] [get_bd_pins result_st_write]
connect_bd_net -net controller_0_op_sel [get_bd_pins op_sel_V] [get_bd_pins op_vec_kernel_0/op_sel_V]
connect_bd_net -net controller_0_in_1_sel [get_bd_pins in1_sel_V] [get_bd_pins op_vec_kernel_0/in1_sel_V]
connect_bd_net -net controller_0_in_2_sel [get_bd_pins in2_sel_V] [get_bd_pins op_vec_kernel_0/in2_sel_V]
connect_bd_net -net controller_0_scale [get_bd_pins scale_V] [get_bd_pins op_vec_kernel_0/scale_V]
connect_bd_net -net controller_0_alpha [get_bd_pins alpha] [get_bd_pins op_vec_kernel_0/alpha]
connect_bd_net [get_bd_pins op_vec_kernel_0/ap_ready] [get_bd_pins ap_done]
connect_bd_net [get_bd_pins fifo_generator_0/empty] [get_bd_pins util_vector_logic_1/Op1]
connect_bd_net [get_bd_pins fifo_generator_0/full] [get_bd_pins util_vector_logic_0/Op1]
connect_bd_net [get_bd_pins op_vec_kernel_0/result_feedback_din] [get_bd_pins fifo_generator_0/din]
connect_bd_net [get_bd_pins util_vector_logic_0/Res] [get_bd_pins op_vec_kernel_0/result_feedback_full_n]
connect_bd_net [get_bd_pins op_vec_kernel_0/result_feedback_write] [get_bd_pins fifo_generator_0/wr_en]
connect_bd_net [get_bd_pins op_vec_kernel_0/in_2_feedback_read] [get_bd_pins fifo_generator_0/rd_en]
connect_bd_net [get_bd_pins util_vector_logic_1/Res] [get_bd_pins op_vec_kernel_0/in_2_feedback_empty_n]
connect_bd_net [get_bd_pins fifo_generator_0/dout] [get_bd_pins op_vec_kernel_0/in_2_feedback_dout]

current_bd_instance /controller
connect_bd_intf_net -intf_net axi_smc_M04_AXI [get_bd_intf_pins S_AXI] [get_bd_intf_pins axi_gpio_1/S_AXI]
connect_bd_net -net controller_gpio_io_o [get_bd_pins axi_gpio_1/gpio_io_o] [get_bd_pins controller_0/start]
connect_bd_net -net processing_system7_0_FCLK_CLK0 [get_bd_pins clk] [get_bd_pins axi_gpio_1/s_axi_aclk] [get_bd_pins controller_0/clk]
connect_bd_net -net rst_ps7_0_100M_peripheral_aresetn [get_bd_pins rst] [get_bd_pins axi_gpio_1/s_axi_aresetn] [get_bd_pins controller_0/rst]
connect_bd_net -net op_vec_kernel_0_ap_done [get_bd_pins op_vec_done] [get_bd_pins controller_0/op_vec_done]
connect_bd_net -net mac_kernel_0_ap_done [get_bd_pins mac_done] [get_bd_pins controller_0/mac_done]
connect_bd_net -net soft_threshold_kernel_0_ap_done [get_bd_pins st_done] [get_bd_pins controller_0/st_done]
connect_bd_net -net IRQ_F2P_1 [get_bd_pins controller_0/done] [get_bd_pins done]
connect_bd_net [get_bd_pins controller_0/scale] [get_bd_pins scale]
connect_bd_net -net op_sel_V_1 [get_bd_pins controller_0/op_sel] [get_bd_pins op_sel]
connect_bd_net -net in1_sel_V_1 [get_bd_pins controller_0/in_1_sel] [get_bd_pins in_1_sel]
connect_bd_net -net alpha_1 [get_bd_pins controller_0/alpha] [get_bd_pins alpha]
connect_bd_net [get_bd_pins controller_0/rho_inv] [get_bd_pins rho_inv]
connect_bd_net -net in2_sel_V_1 [get_bd_pins controller_0/in_2_sel] [get_bd_pins in_2_sel]
connect_bd_net -net ap_start_1 [get_bd_pins controller_0/op_vec_start] [get_bd_pins op_vec_start]
connect_bd_net [get_bd_pins controller_0/mac_start] [get_bd_pins mac_start]
connect_bd_net [get_bd_pins controller_0/st_start] [get_bd_pins st_start]
connect_bd_net [get_bd_pins controller_0/st_ctr] [get_bd_pins st_ctr]
connect_bd_net [get_bd_pins terminate] [get_bd_pins controller_0/terminate]
connect_bd_net [get_bd_pins controller_0/td_start] [get_bd_pins td_start]
connect_bd_net [get_bd_pins controller_0/rho] [get_bd_pins rho]

current_bd_instance /z_td_fifo
connect_bd_net [get_bd_pins fifo_generator_3/full] [get_bd_pins util_vector_logic_0/Op1]
connect_bd_net [get_bd_pins fifo_generator_3/empty] [get_bd_pins util_vector_logic_4/Op1]
connect_bd_net [get_bd_pins util_vector_logic_0/Res] [get_bd_pins Res]
connect_bd_net -net processing_system7_0_FCLK_CLK0 [get_bd_pins clk] [get_bd_pins fifo_generator_3/clk]
connect_bd_net -net rst_ps7_0_100M_peripheral_reset [get_bd_pins srst] [get_bd_pins fifo_generator_3/srst]
connect_bd_net -net soft_threshold_kernel_0_z_td_din [get_bd_pins din] [get_bd_pins fifo_generator_3/din]
connect_bd_net -net soft_threshold_kernel_0_z_td_write [get_bd_pins wr_en] [get_bd_pins fifo_generator_3/wr_en]
connect_bd_net -net termination_detector_0_z_td_read [get_bd_pins rd_en] [get_bd_pins fifo_generator_3/rd_en]
connect_bd_net [get_bd_pins fifo_generator_3/dout] [get_bd_pins dout]
connect_bd_net [get_bd_pins util_vector_logic_4/Res] [get_bd_pins Res1]

current_bd_instance /x_td_fifo
connect_bd_net [get_bd_pins fifo_generator_0/full] [get_bd_pins util_vector_logic_3/Op1]
connect_bd_net [get_bd_pins fifo_generator_0/empty] [get_bd_pins util_vector_logic_5/Op1]
connect_bd_net [get_bd_pins util_vector_logic_3/Res] [get_bd_pins Res]
connect_bd_net -net processing_system7_0_FCLK_CLK0 [get_bd_pins clk] [get_bd_pins fifo_generator_0/clk]
connect_bd_net -net rst_ps7_0_100M_peripheral_reset [get_bd_pins srst] [get_bd_pins fifo_generator_0/srst]
connect_bd_net -net soft_threshold_kernel_0_x_td_din [get_bd_pins din] [get_bd_pins fifo_generator_0/din]
connect_bd_net -net soft_threshold_kernel_0_x_td_write [get_bd_pins wr_en] [get_bd_pins fifo_generator_0/wr_en]
connect_bd_net -net termination_detector_0_x_td_read [get_bd_pins rd_en] [get_bd_pins fifo_generator_0/rd_en]
connect_bd_net [get_bd_pins fifo_generator_0/dout] [get_bd_pins dout]
connect_bd_net [get_bd_pins util_vector_logic_5/Res] [get_bd_pins Res1]

current_bd_instance /zold_td_fifo
connect_bd_net [get_bd_pins fifo_generator_2/full] [get_bd_pins util_vector_logic_1/Op1]
connect_bd_net [get_bd_pins fifo_generator_2/empty] [get_bd_pins util_vector_logic_2/Op1]
connect_bd_net [get_bd_pins util_vector_logic_1/Res] [get_bd_pins Res]
connect_bd_net -net processing_system7_0_FCLK_CLK0 [get_bd_pins clk] [get_bd_pins fifo_generator_2/clk]
connect_bd_net -net rst_ps7_0_100M_peripheral_reset [get_bd_pins srst] [get_bd_pins fifo_generator_2/srst]
connect_bd_net -net soft_threshold_kernel_0_z_old_td_din [get_bd_pins din] [get_bd_pins fifo_generator_2/din]
connect_bd_net -net soft_threshold_kernel_0_z_old_td_write [get_bd_pins wr_en] [get_bd_pins fifo_generator_2/wr_en]
connect_bd_net -net termination_detector_0_z_old_td_read [get_bd_pins rd_en] [get_bd_pins fifo_generator_2/rd_en]
connect_bd_net [get_bd_pins fifo_generator_2/dout] [get_bd_pins dout]
connect_bd_net [get_bd_pins util_vector_logic_2/Res] [get_bd_pins Res1]

current_bd_instance /u_td_fifo
connect_bd_net [get_bd_pins fifo_generator_1/full] [get_bd_pins util_vector_logic_6/Op1]
connect_bd_net [get_bd_pins fifo_generator_1/empty] [get_bd_pins util_vector_logic_7/Op1]
connect_bd_net [get_bd_pins util_vector_logic_6/Res] [get_bd_pins Res]
connect_bd_net -net processing_system7_0_FCLK_CLK0 [get_bd_pins clk] [get_bd_pins fifo_generator_1/clk]
connect_bd_net -net rst_ps7_0_100M_peripheral_reset [get_bd_pins srst] [get_bd_pins fifo_generator_1/srst]
connect_bd_net -net soft_threshold_kernel_0_u_td_din [get_bd_pins din] [get_bd_pins fifo_generator_1/din]
connect_bd_net -net soft_threshold_kernel_0_u_td_write [get_bd_pins wr_en] [get_bd_pins fifo_generator_1/wr_en]
connect_bd_net -net termination_detector_0_u_td_read [get_bd_pins rd_en] [get_bd_pins fifo_generator_1/rd_en]
connect_bd_net [get_bd_pins fifo_generator_1/dout] [get_bd_pins dout]
connect_bd_net [get_bd_pins util_vector_logic_7/Res] [get_bd_pins Res1]

current_bd_instance /
connect_bd_intf_net -intf_net op_vec_kernel_0_in_2_bram_q_PORTA [get_bd_intf_pins op_vec_kernel/in_2_bram_q_PORTA] [get_bd_intf_pins q_bram/BRAM_PORTB]
connect_bd_intf_net -intf_net processing_system7_0_DDR [get_bd_intf_ports DDR] [get_bd_intf_pins PS/DDR]
connect_bd_intf_net -intf_net processing_system7_0_FIXED_IO [get_bd_intf_ports FIXED_IO] [get_bd_intf_pins PS/FIXED_IO]
connect_bd_intf_net [get_bd_intf_pins axi_smc/M02_AXI] [get_bd_intf_pins q_bram/S_AXI]
connect_bd_intf_net -intf_net op_vec_kernel_0_in_2_bram_u_PORTA [get_bd_intf_pins op_vec_kernel/in_2_bram_u_PORTA] [get_bd_intf_pins op_vec_kernel_0_bram/BRAM_PORTA]
connect_bd_intf_net -intf_net processing_system7_0_M_AXI_GP0 [get_bd_intf_pins PS/M_AXI_GP0] [get_bd_intf_pins axi_smc/S00_AXI]
connect_bd_intf_net [get_bd_intf_pins axi_smc/M03_AXI] [get_bd_intf_pins x_bram/S_AXI]
connect_bd_intf_net [get_bd_intf_pins axi_smc/M01_AXI] [get_bd_intf_pins axi_gpio_0/S_AXI]
connect_bd_intf_net -intf_net op_vec_kernel_0_in_1_bram_z_PORTA [get_bd_intf_pins op_vec_kernel/in_1_bram_z_PORTA] [get_bd_intf_pins mac_kernel_0_bram_0/BRAM_PORTA]
connect_bd_intf_net [get_bd_intf_pins x_bram/BRAM_PORTA] [get_bd_intf_pins termination_detector_0/x_out_PORTA]
connect_bd_intf_net [get_bd_intf_pins axi_smc/M04_AXI] [get_bd_intf_pins controller/S_AXI]
connect_bd_intf_net [get_bd_intf_pins soft_threshold_kernel_0/u_bram_PORTA] [get_bd_intf_pins op_vec_kernel_0_bram/BRAM_PORTB]
connect_bd_intf_net [get_bd_intf_pins axi_smc/M00_AXI] [get_bd_intf_pins p_bram/S_AXI]
connect_bd_net -net processing_system7_0_FCLK_CLK0 [get_bd_pins PS/FCLK_CLK0] \
  [get_bd_pins axi_smc/aclk] [get_bd_pins mac_kernel_0/ap_clk] [get_bd_pins q_bram/s_axi_aclk] \
  [get_bd_pins x_bram/s_axi_aclk] [get_bd_pins p_bram/s_axi_aclk] [get_bd_pins vec_mac_fifo/clk] \
  [get_bd_pins mac_vec_fifo/clk] [get_bd_pins vec_st_fifo/clk] [get_bd_pins op_vec_kernel/clk] [get_bd_pins controller/clk] \
  [get_bd_pins axi_gpio_0/s_axi_aclk] [get_bd_pins soft_threshold_kernel_0/ap_clk] [get_bd_pins mac_kernel_0_bram_0/clkb] \
  [get_bd_pins z_td_fifo/clk] [get_bd_pins x_td_fifo/clk] [get_bd_pins zold_td_fifo/clk] [get_bd_pins u_td_fifo/clk] \
  [get_bd_pins termination_detector_0/ap_clk]
connect_bd_net -net rst_ps7_0_100M_peripheral_reset [get_bd_pins PS/peripheral_reset] \
  [get_bd_pins mac_kernel_0/ap_rst] [get_bd_pins vec_mac_fifo/srst] [get_bd_pins mac_vec_fifo/srst] \
  [get_bd_pins vec_st_fifo/srst] [get_bd_pins op_vec_kernel/srst] [get_bd_pins soft_threshold_kernel_0/ap_rst] \
  [get_bd_pins z_td_fifo/srst] [get_bd_pins x_td_fifo/srst] [get_bd_pins zold_td_fifo/srst] [get_bd_pins u_td_fifo/srst] \
  [get_bd_pins termination_detector_0/ap_rst]
connect_bd_net -net mac_kernel_0_bram_douta [get_bd_pins p_bram/douta] [get_bd_pins mac_kernel_0/p_q0]
connect_bd_net [get_bd_pins mac_kernel_0/p_d0] [get_bd_pins p_bram/dina]
connect_bd_net [get_bd_pins mac_kernel_0/p_we0] [get_bd_pins p_bram/wea]
connect_bd_net [get_bd_pins mac_kernel_0/p_ce0] [get_bd_pins p_bram/ena]
connect_bd_net -net rst_ps7_0_100M_peripheral_aresetn [get_bd_pins PS/peripheral_aresetn] \
  [get_bd_pins axi_smc/aresetn] [get_bd_pins q_bram/s_axi_aresetn] [get_bd_pins x_bram/s_axi_aresetn] \
  [get_bd_pins p_bram/s_axi_aresetn] [get_bd_pins controller/rst] [get_bd_pins axi_gpio_0/s_axi_aresetn]
connect_bd_net -net op_vec_kernel_0_result_mac_write [get_bd_pins op_vec_kernel/result_mac_write] [get_bd_pins vec_mac_fifo/wr_en]
connect_bd_net -net op_vec_kernel_0_result_mac_din [get_bd_pins op_vec_kernel/result_mac_din] [get_bd_pins vec_mac_fifo/din]
connect_bd_net -net util_vector_logic_0_Res [get_bd_pins vec_mac_fifo/Res] [get_bd_pins op_vec_kernel/result_mac_full_n]
connect_bd_net -net op_vec_kernel_0_ap_done [get_bd_pins op_vec_kernel/ap_done] [get_bd_pins controller/op_vec_done]
connect_bd_net [get_bd_pins mac_kernel_0/result_din] [get_bd_pins mac_vec_fifo/din]
connect_bd_net [get_bd_pins mac_kernel_0/result_write] [get_bd_pins mac_vec_fifo/wr_en]
connect_bd_net -net util_vector_logic_1_Res [get_bd_pins mac_vec_fifo/Res] [get_bd_pins mac_kernel_0/result_full_n]
connect_bd_net -net fifo_generator_1_dout [get_bd_pins mac_vec_fifo/dout] [get_bd_pins op_vec_kernel/in_1_mac_dout]
connect_bd_net -net util_vector_logic_2_Res [get_bd_pins mac_vec_fifo/Res1] [get_bd_pins op_vec_kernel/in_1_mac_empty_n]
connect_bd_net -net op_vec_kernel_0_in_1_mac_read [get_bd_pins op_vec_kernel/in_1_mac_read] [get_bd_pins mac_vec_fifo/rd_en]
connect_bd_net -net fifo_generator_0_dout [get_bd_pins vec_mac_fifo/dout] [get_bd_pins mac_kernel_0/z_u_dout]
connect_bd_net [get_bd_pins mac_kernel_0/z_u_read] [get_bd_pins vec_mac_fifo/rd_en]
connect_bd_net -net util_vector_logic_5_Res [get_bd_pins vec_mac_fifo/Res1] [get_bd_pins mac_kernel_0/z_u_empty_n]
connect_bd_net -net fifo_generator_2_dout [get_bd_pins vec_st_fifo/dout] [get_bd_pins soft_threshold_kernel_0/x_dout]
connect_bd_net -net util_vector_logic_4_Res [get_bd_pins vec_st_fifo/Res] [get_bd_pins soft_threshold_kernel_0/x_empty_n]
connect_bd_net [get_bd_pins soft_threshold_kernel_0/x_read] [get_bd_pins vec_st_fifo/rd_en]
connect_bd_net -net util_vector_logic_3_Res [get_bd_pins vec_st_fifo/Res1] [get_bd_pins op_vec_kernel/result_st_full_n]
connect_bd_net -net op_vec_kernel_0_result_st_din [get_bd_pins op_vec_kernel/result_st_din] [get_bd_pins vec_st_fifo/din]
connect_bd_net -net op_vec_kernel_0_result_st_write [get_bd_pins op_vec_kernel/result_st_write] [get_bd_pins vec_st_fifo/wr_en]
connect_bd_net [get_bd_pins mac_kernel_0/ap_done] [get_bd_pins controller/mac_done]
connect_bd_net -net controller_0_scale [get_bd_pins controller/scale] [get_bd_pins op_vec_kernel/scale_V]
connect_bd_net -net op_sel_V_1 [get_bd_pins controller/op_sel] [get_bd_pins op_vec_kernel/op_sel_V]
connect_bd_net -net in1_sel_V_1 [get_bd_pins controller/in_1_sel] [get_bd_pins op_vec_kernel/in1_sel_V]
connect_bd_net -net alpha_1 [get_bd_pins controller/alpha] [get_bd_pins op_vec_kernel/alpha]
connect_bd_net -net controller_0_rho_inv [get_bd_pins controller/rho_inv] [get_bd_pins soft_threshold_kernel_0/rho_inv]
connect_bd_net -net in2_sel_V_1 [get_bd_pins controller/in_2_sel] [get_bd_pins op_vec_kernel/in2_sel_V]
connect_bd_net -net ap_start_1 [get_bd_pins controller/op_vec_start] [get_bd_pins op_vec_kernel/ap_start]
connect_bd_net [get_bd_pins controller/done] [get_bd_pins PS/IRQ_F2P]
connect_bd_net [get_bd_pins controller/st_ctr] [get_bd_pins axi_gpio_0/gpio_io_i]
connect_bd_net [get_bd_pins controller/st_start] [get_bd_pins soft_threshold_kernel_0/ap_start]
connect_bd_net [get_bd_pins xlconstant_0/dout] [get_bd_pins mac_kernel_0/ap_start]
connect_bd_net [get_bd_pins soft_threshold_kernel_0/ap_ready] [get_bd_pins controller/st_done]
connect_bd_net [get_bd_pins mac_kernel_0/p_address0] [get_bd_pins xlconcat_0/In1]
connect_bd_net [get_bd_pins xlconstant_1/dout] [get_bd_pins xlconcat_0/In0]
connect_bd_net [get_bd_pins xlconcat_0/dout] [get_bd_pins p_bram/addra]
connect_bd_net [get_bd_pins mac_kernel_0_bram_0/doutb] [get_bd_pins soft_threshold_kernel_0/result_z_q0]
connect_bd_net [get_bd_pins soft_threshold_kernel_0/result_z_d0] [get_bd_pins mac_kernel_0_bram_0/dinb]
connect_bd_net [get_bd_pins soft_threshold_kernel_0/result_z_ce0] [get_bd_pins mac_kernel_0_bram_0/enb]
connect_bd_net [get_bd_pins xlconstant_2/dout] [get_bd_pins xlconcat_1/In0]
connect_bd_net [get_bd_pins xlconcat_1/dout] [get_bd_pins mac_kernel_0_bram_0/addrb]
connect_bd_net [get_bd_pins soft_threshold_kernel_0/result_z_address0] [get_bd_pins xlconcat_1/In1]
connect_bd_net [get_bd_pins soft_threshold_kernel_0/result_z_we0] [get_bd_pins mac_kernel_0_bram_0/web]
connect_bd_net [get_bd_pins termination_detector_0/terminate] [get_bd_pins controller/terminate]
connect_bd_net [get_bd_pins controller/td_start] [get_bd_pins termination_detector_0/ap_start]
connect_bd_net [get_bd_pins controller/rho] [get_bd_pins termination_detector_0/rho]
connect_bd_net -net util_vector_logic_5_Res1 [get_bd_pins x_td_fifo/Res1] [get_bd_pins termination_detector_0/x_td_empty_n]
connect_bd_net -net fifo_generator_0_dout1 [get_bd_pins x_td_fifo/dout] [get_bd_pins termination_detector_0/x_td_dout]
connect_bd_net [get_bd_pins termination_detector_0/x_td_read] [get_bd_pins x_td_fifo/rd_en]
connect_bd_net -net util_vector_logic_4_Res1 [get_bd_pins z_td_fifo/Res1] [get_bd_pins termination_detector_0/z_td_empty_n]
connect_bd_net -net fifo_generator_3_dout [get_bd_pins z_td_fifo/dout] [get_bd_pins termination_detector_0/z_td_dout]
connect_bd_net [get_bd_pins termination_detector_0/z_td_read] [get_bd_pins z_td_fifo/rd_en]
connect_bd_net -net util_vector_logic_7_Res [get_bd_pins u_td_fifo/Res1] [get_bd_pins termination_detector_0/u_td_empty_n]
connect_bd_net -net fifo_generator_1_dout1 [get_bd_pins u_td_fifo/dout] [get_bd_pins termination_detector_0/u_td_dout]
connect_bd_net [get_bd_pins termination_detector_0/u_td_read] [get_bd_pins u_td_fifo/rd_en]
connect_bd_net -net util_vector_logic_2_Res1 [get_bd_pins zold_td_fifo/Res1] [get_bd_pins termination_detector_0/z_old_td_empty_n]
connect_bd_net -net fifo_generator_2_dout1 [get_bd_pins zold_td_fifo/dout] [get_bd_pins termination_detector_0/z_old_td_dout]
connect_bd_net [get_bd_pins termination_detector_0/z_old_td_read] [get_bd_pins zold_td_fifo/rd_en]
connect_bd_net -net util_vector_logic_3_Res1 [get_bd_pins x_td_fifo/Res] [get_bd_pins soft_threshold_kernel_0/x_td_full_n]
connect_bd_net -net util_vector_logic_0_Res1 [get_bd_pins z_td_fifo/Res] [get_bd_pins soft_threshold_kernel_0/z_td_full_n]
connect_bd_net -net util_vector_logic_6_Res [get_bd_pins u_td_fifo/Res] [get_bd_pins soft_threshold_kernel_0/u_td_full_n]
connect_bd_net -net util_vector_logic_1_Res1 [get_bd_pins zold_td_fifo/Res] [get_bd_pins soft_threshold_kernel_0/z_old_td_full_n]
connect_bd_net [get_bd_pins soft_threshold_kernel_0/x_td_din] [get_bd_pins x_td_fifo/din]
connect_bd_net [get_bd_pins soft_threshold_kernel_0/x_td_write] [get_bd_pins x_td_fifo/wr_en]
connect_bd_net [get_bd_pins soft_threshold_kernel_0/z_td_din] [get_bd_pins z_td_fifo/din]
connect_bd_net [get_bd_pins soft_threshold_kernel_0/z_td_write] [get_bd_pins z_td_fifo/wr_en]
connect_bd_net [get_bd_pins soft_threshold_kernel_0/u_td_din] [get_bd_pins u_td_fifo/din]
connect_bd_net [get_bd_pins soft_threshold_kernel_0/u_td_write] [get_bd_pins u_td_fifo/wr_en]
connect_bd_net [get_bd_pins soft_threshold_kernel_0/z_old_td_din] [get_bd_pins zold_td_fifo/din]
connect_bd_net [get_bd_pins soft_threshold_kernel_0/z_old_td_write] [get_bd_pins zold_td_fifo/wr_en]

# ---- address map ----
assign_bd_address -offset 0x40000000 -range 8K -target_address_space [get_bd_addr_spaces PS/processing_system7_0/Data] [get_bd_addr_segs x_bram/axi_bram_ctrl_4/S_AXI/Mem0]
assign_bd_address -offset 0x41200000 -range 64K -target_address_space [get_bd_addr_spaces PS/processing_system7_0/Data] [get_bd_addr_segs axi_gpio_0/S_AXI/Reg]
assign_bd_address -offset 0x41210000 -range 64K -target_address_space [get_bd_addr_spaces PS/processing_system7_0/Data] [get_bd_addr_segs controller/axi_gpio_1/S_AXI/Reg]
assign_bd_address -offset 0x44000000 -range 8K -target_address_space [get_bd_addr_spaces PS/processing_system7_0/Data] [get_bd_addr_segs q_bram/axi_bram_ctrl_2/S_AXI/Mem0]
assign_bd_address -offset 0x4B000000 -range 8K -target_address_space [get_bd_addr_spaces PS/processing_system7_0/Data] [get_bd_addr_segs p_bram/axi_bram_ctrl_0/S_AXI/Mem0]

set_property USER_COMMENTS.comment_1 {VECTOR Z} [get_bd_cells /mac_kernel_0_bram_0]
set_property USER_COMMENTS.comment_2 {VECTOR U} [get_bd_cells /op_vec_kernel_0_bram]
set_property USER_COMMENTS.comment_0 {MATRIX P} [get_bd_cells /p_bram/mac_kernel_0_bram]
set_property USER_COMMENTS.comment_3 {VECTOR Q} [get_bd_cells /q_bram/axi_bram_ctrl_2_bram]
set_property USER_COMMENTS.comment_4 x_td [get_bd_cells /x_td_fifo/fifo_generator_0]

validate_bd_design
save_bd_design
